# Altium schematic sheet 05_Zynq_Config.SchDoc
size A2; SheetNumber: 6; SheetTotal: 7
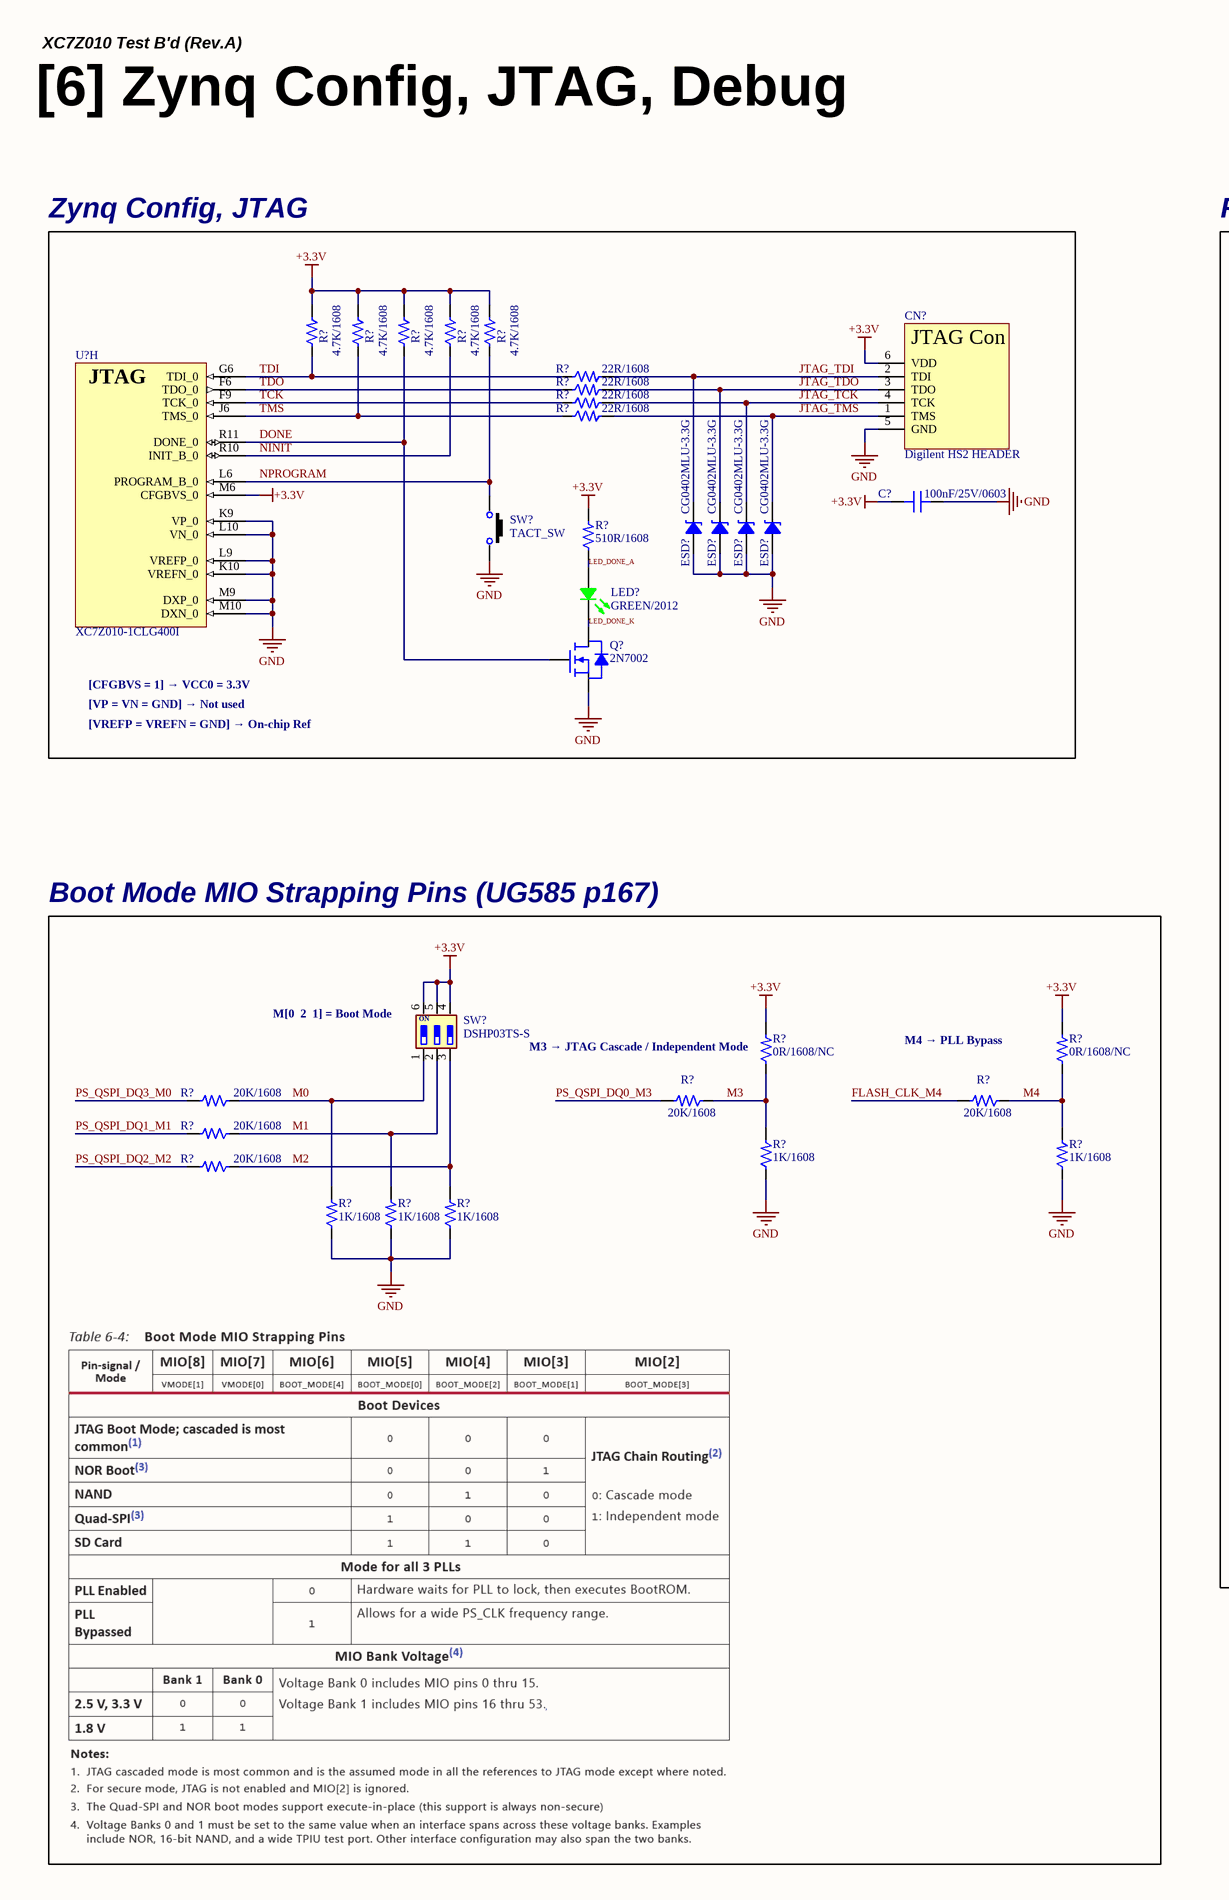
[diagram p0: 05_Zynq_Config.SchDoc, left]
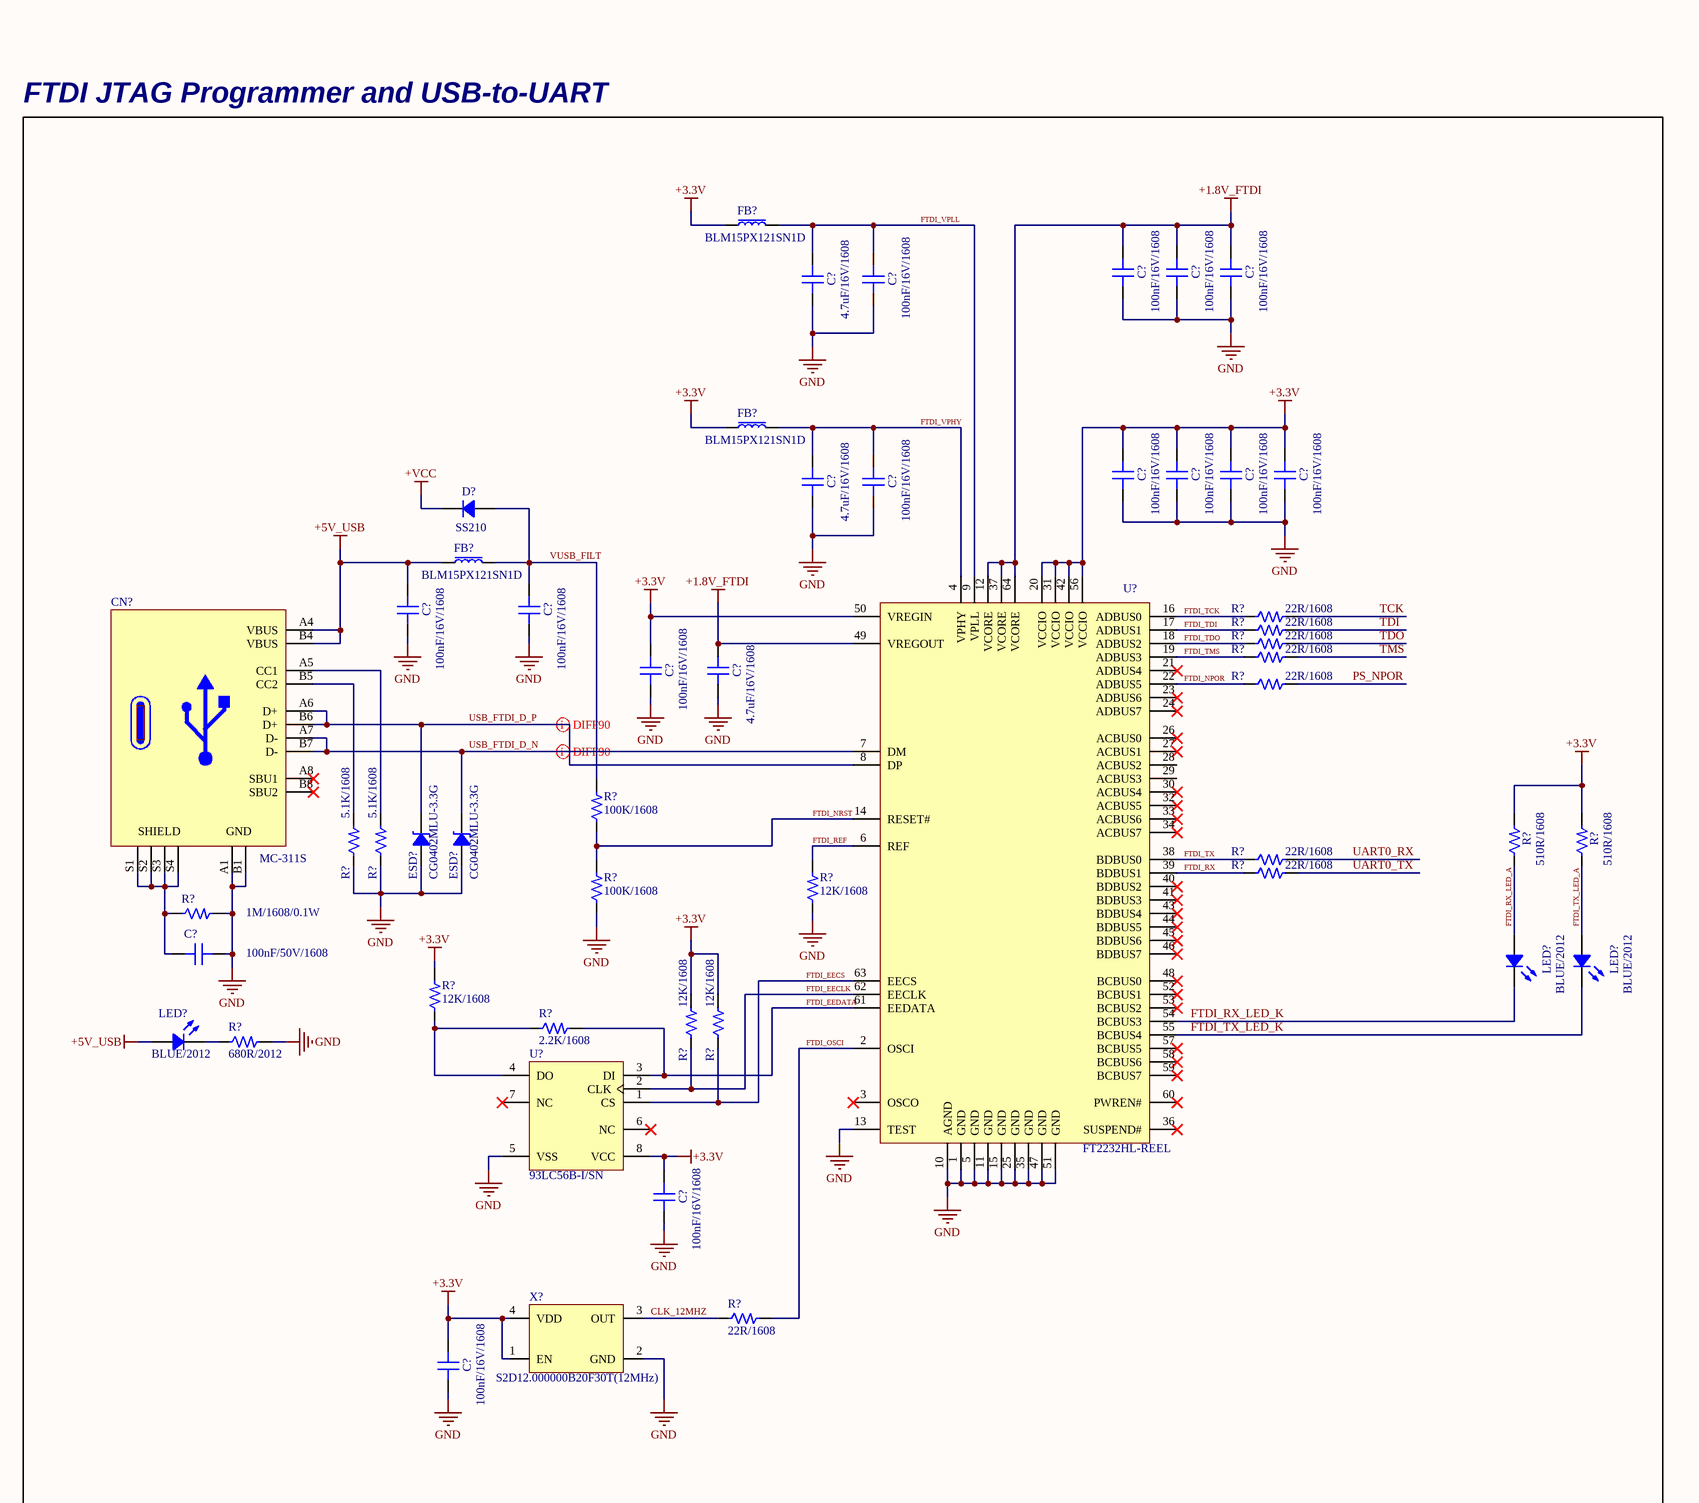
[diagram p1: 05_Zynq_Config.SchDoc, right]

## Parts
(Parts that share a designator on the sheet are numbered #1, #2 ... from top to bottom, then left to right.)
C?#1  100nF/16V/1608  [CAP 1608 (0603_INCH)]
C?#2  100nF/16V/1608  [CAP 1608 (0603_INCH)]
C?#3  100nF/16V/1608  [CAP 1608 (0603_INCH)]
C?#4  4.7uF/16V/1608  [CAP 1608 (0603_INCH)]
C?#5  100nF/16V/1608  [CAP 1608 (0603_INCH)]
C?#6  100nF/25V/0603  [CAP 0603 (0201_INCH)]
C?#7  100nF/16V/1608  [CAP 1608 (0603_INCH)]
C?#8  100nF/16V/1608  [CAP 1608 (0603_INCH)]
C?#9  100nF/16V/1608  [CAP 1608 (0603_INCH)]
C?#10  100nF/16V/1608  [CAP 1608 (0603_INCH)]
C?#11  4.7uF/16V/1608  [CAP 1608 (0603_INCH)]
C?#12  100nF/16V/1608  [CAP 1608 (0603_INCH)]
C?#13  100nF/16V/1608  [CAP 1608 (0603_INCH)]
C?#14  100nF/16V/1608  [CAP 1608 (0603_INCH)]
C?#15  100nF/16V/1608  [CAP 1608 (0603_INCH)]
C?#16  4.7uF/16V/1608  [CAP 1608 (0603_INCH)]
C?#17  100nF/50V/1608  [CAP 1608 (0603_INCH)]
C?#18  100nF/16V/1608  [CAP 1608 (0603_INCH)]
C?#19  100nF/16V/1608  [CAP 1608 (0603_INCH)]
CN?#1  Digilent HS2 HEADER
CN?#2  MC-311S  [CON USB-Type-C (16P)]
D?  SS210  [DIO DO-214AC (SMA)]
ESD?#1  CG0402MLU-3.3G  [RES 1005 (0402_inch)]
ESD?#2  CG0402MLU-3.3G  [RES 1005 (0402_inch)]
ESD?#3  CG0402MLU-3.3G  [RES 1005 (0402_inch)]
ESD?#4  CG0402MLU-3.3G  [RES 1005 (0402_inch)]
ESD?#5  CG0402MLU-3.3G  [RES 1005 (0402_inch)]
ESD?#6  CG0402MLU-3.3G  [RES 1005 (0402_inch)]
FB?#1  BLM15PX121SN1D  [FB 1005 (0402_inch)]
FB?#2  BLM15PX121SN1D  [FB 1005 (0402_inch)]
FB?#3  BLM15PX121SN1D  [FB 1005 (0402_inch)]
LED?#1  GREEN/2012  [LED MHT170RGBCT (GREEN)]
LED?#2  BLUE/2012  [LED MHT170RGBCT (BLUE)]
LED?#3  BLUE/2012  [LED MHT170RGBCT (BLUE)]
LED?#4  BLUE/2012  [LED MHT170RGBCT (BLUE)]
Q?  2N7002  [SOT 23-3 (DIODES INCORPORATED)]
R?#1  4.7K/1608  [RES 1608 (0603_inch)]
R?#2  4.7K/1608  [RES 1608 (0603_inch)]
R?#3  4.7K/1608  [RES 1608 (0603_inch)]
R?#4  4.7K/1608  [RES 1608 (0603_inch)]
R?#5  4.7K/1608  [RES 1608 (0603_inch)]
R?#6  22R/1608  [RES 1608 (0603_inch)]
R?#7  22R/1608  [RES 1608 (0603_inch)]
R?#8  22R/1608  [RES 1608 (0603_inch)]
R?#9  22R/1608  [RES 1608 (0603_inch)]
R?#10  510R/1608  [RES 1608 (0603_inch)]
R?#11  22R/1608  [RES 1608 (0603_inch)]
R?#12  22R/1608  [RES 1608 (0603_inch)]
R?#13  22R/1608  [RES 1608 (0603_inch)]
R?#14  22R/1608  [RES 1608 (0603_inch)]
R?#15  22R/1608  [RES 1608 (0603_inch)]
R?#16  100K/1608  [RES 1608 (0603_inch)]
R?#17  5.1K/1608  [RES 1608 (0603_inch)]
R?#18  5.1K/1608  [RES 1608 (0603_inch)]
R?#19  510R/1608  [RES 1608 (0603_inch)]
R?#20  510R/1608  [RES 1608 (0603_inch)]
R?#21  22R/1608  [RES 1608 (0603_inch)]
R?#22  22R/1608  [RES 1608 (0603_inch)]
R?#23  100K/1608  [RES 1608 (0603_inch)]
R?#24  12K/1608  [RES 1608 (0603_inch)]
R?#25  1M/1608/0.1W  [RES 1608 (0603_inch)]
R?#26  0R/1608/NC  [RES 1608 (0603_inch)/NC]
R?#27  0R/1608/NC  [RES 1608 (0603_inch)/NC]
R?#28  12K/1608  [RES 1608 (0603_inch)]
R?#29  20K/1608  [RES 1608 (0603_inch)]
R?#30  20K/1608  [RES 1608 (0603_inch)]
R?#31  20K/1608  [RES 1608 (0603_inch)]
R?#32  12K/1608  [RES 1608 (0603_inch)]
R?#33  12K/1608  [RES 1608 (0603_inch)]
R?#34  2.2K/1608  [RES 1608 (0603_inch)]
R?#35  20K/1608  [RES 1608 (0603_inch)]
R?#36  680R/2012  [RES 2012 (0805_inch)]
R?#37  1K/1608  [RES 1608 (0603_inch)]
R?#38  1K/1608  [RES 1608 (0603_inch)]
R?#39  20K/1608  [RES 1608 (0603_inch)]
R?#40  1K/1608  [RES 1608 (0603_inch)]
R?#41  1K/1608  [RES 1608 (0603_inch)]
R?#42  1K/1608  [RES 1608 (0603_inch)]
R?#43  22R/1608  [RES 1608 (0603_inch)]
SW?#1  TACT_SW  [SW K2-1102SP-C4SC-04]
SW?#2  DSHP03TS-S  [SW YSS-1201S-2mm]
U?#1  XC7Z010-1CLG400I  (part H of 9)
U?#2  FT2232HL-REEL
U?#3  93LC56B-I/SN
X?  S2D12.000000B20F30T(12MHz)  [OSC SMD_2.5x2.0 (SCTF)]

## Blocks framed on the sheet
Zynq Config, JTAG: C?#6 CN?#1 ESD?#1-ESD?#4 LED?#1 Q? R?#1-R?#10 SW?#1 U?#1
FTDI JTAG Programmer and USB-to-UART: C?#1-C?#5 C?#7-C?#19 CN?#2 D? ESD?#5 ESD?#6 FB?#1-FB?#3 LED?#2-LED?#4 R?#11-R?#25 R?#28 R?#32-R?#34 R?#36 R?#43 U?#2 U?#3 X?
Boot Mode MIO Strapping Pins (UG585 p167): R?#26 R?#27 R?#29-R?#31 R?#35 R?#37-R?#42 SW?#2

## Nets
+1.8V_FTDI: C?#1.2 C?#2.2 C?#3.2 C?#16.2 U?#2.12(VCORE) U?#2.37(VCORE) U?#2.49(VREGOUT) U?#2.64(VCORE)
+3.3V: C?#6.2 C?#7.2 C?#8.2 C?#9.2 C?#10.2 C?#15.2 C?#18.2 C?#19.2 CN?#1.6(VDD) FB?#1.1 FB?#2.1 R?#1.2 R?#2.2 R?#3.2 R?#4.2 R?#5.2 R?#10.2 R?#19.2 R?#20.2 R?#26.2 R?#27.2 R?#28.2 R?#32.2 R?#33.2 SW?#2.4 SW?#2.5 SW?#2.6 U?#1.M6(CFGBVS_0) U?#2.20(VCCIO) U?#2.31(VCCIO) U?#2.42(VCCIO) U?#2.50(VREGIN) U?#2.56(VCCIO) U?#3.8(VCC) X?.1(EN) X?.4(VDD)
+5V_USB: C?#13.2 CN?#2.A4(VBUS) CN?#2.B4(VBUS) FB?#3.1 LED?#4.4(Common_Anode)
+VCC: D?.2
GND: C?#1.1 C?#2.1 C?#3.1 C?#4.1 C?#5.1 C?#6.1 C?#7.1 C?#8.1 C?#9.1 C?#10.1 C?#11.1 C?#12.1 C?#13.1 C?#14.1 C?#15.1 C?#16.1 C?#17.2 C?#18.1 C?#19.1 CN?#1.5(GND) CN?#2.A1(GND) CN?#2.B1(GND) ESD?#1.1 ESD?#2.1 ESD?#3.1 ESD?#4.1 ESD?#5.1 ESD?#6.1 Q?.2(S) R?#17.1 R?#18.1 R?#23.1 R?#24.1 R?#25.2 R?#36.2 R?#37.1 R?#38.1 R?#40.1 R?#41.1 R?#42.1 SW?#1.3 U?#1.K9(VP_0) U?#1.K10(VREFN_0) U?#1.L9(VREFP_0) U?#1.L10(VN_0) U?#1.M9(DXP_0) U?#1.M10(DXN_0) U?#2.1(GND) U?#2.5(GND) U?#2.10(AGND) U?#2.11(GND) U?#2.13(TEST) U?#2.15(GND) U?#2.25(GND) U?#2.35(GND) U?#2.47(GND) U?#2.51(GND) U?#3.5(VSS) X?.2(GND)
CLK_12MHZ: R?#43.1 X?.3(OUT)
DONE: Q?.1(G) R?#3.1 U?#1.R11(DONE_0)
FLASH_CLK_M4: R?#31.2
FTDI_EECLK: R?#32.1 U?#2.62(EECLK) U?#3.2(CLK)
FTDI_EECS: R?#33.1 U?#2.63(EECS) U?#3.1(CS)
FTDI_EEDATA: R?#34.2 U?#2.61(EEDATA) U?#3.3(DI)
FTDI_NPOR: R?#15.1 U?#2.22(ADBUS5)
FTDI_NRST: R?#16.1 R?#23.2 U?#2.14(RESET#)
FTDI_OSCI: R?#43.2 U?#2.2(OSCI)
FTDI_REF: R?#24.2 U?#2.6(REF)
FTDI_RX: R?#22.1 U?#2.39(BDBUS1)
FTDI_RX_LED_A: LED?#2.4(Common_Anode) R?#19.1
FTDI_RX_LED_K: LED?#2.3(BLUE) U?#2.54(BCBUS3)
FTDI_TCK: R?#11.1 U?#2.16(ADBUS0)
FTDI_TDI: R?#12.1 U?#2.17(ADBUS1)
FTDI_TDO: R?#13.1 U?#2.18(ADBUS2)
FTDI_TMS: R?#14.1 U?#2.19(ADBUS3)
FTDI_TX: R?#21.1 U?#2.38(BDBUS0)
FTDI_TX_LED_A: LED?#3.4(Common_Anode) R?#20.1
FTDI_TX_LED_K: LED?#3.3(BLUE) U?#2.55(BCBUS4)
FTDI_VPHY: C?#11.2 C?#12.2 FB?#2.2 U?#2.4(VPHY)
FTDI_VPLL: C?#4.2 C?#5.2 FB?#1.2 U?#2.9(VPLL)
JTAG_TCK: CN?#1.4(TCK) ESD?#3.2 R?#8.2
JTAG_TDI: CN?#1.2(TDI) ESD?#1.2 R?#6.2
JTAG_TDO: CN?#1.3(TDO) ESD?#2.2 R?#7.2
JTAG_TMS: CN?#1.1(TMS) ESD?#4.2 R?#9.2
LED_DONE_A: LED?#1.4(Common_Anode) R?#10.1
LED_DONE_K: LED?#1.2(GREEN) Q?.3(D)
M0: R?#29.1 R?#40.2 SW?#2.1
M1: R?#35.1 R?#41.2 SW?#2.2
M2: R?#39.1 R?#42.2 SW?#2.3
M3: R?#26.1 R?#30.1 R?#37.2
M4: R?#27.1 R?#31.1 R?#38.2
NINIT: R?#4.1 U?#1.R10(INIT_B_0)
NPROGRAM: R?#5.1 SW?#1.1 U?#1.L6(PROGRAM_B_0)
PS_NPOR: R?#15.2
PS_QSPI_DQ0_M3: R?#30.2
PS_QSPI_DQ1_M1: R?#35.2
PS_QSPI_DQ2_M2: R?#39.2
PS_QSPI_DQ3_M0: R?#29.2
TCK: R?#8.1 R?#11.2 U?#1.F9(TCK_0)
TDI: R?#1.1 R?#6.1 R?#12.2 U?#1.G6(TDI_0)
TDO: R?#7.1 R?#13.2 U?#1.F6(TDO_0)
TMS: R?#2.1 R?#9.1 R?#14.2 U?#1.J6(TMS_0)
UART0_RX: R?#21.2
UART0_TX: R?#22.2
USB_FTDI_D_N: CN?#2.A7(D-) CN?#2.B7(D-) ESD?#6.2 U?#2.7(DM)
USB_FTDI_D_P: CN?#2.A6(D+) CN?#2.B6(D+) ESD?#5.2 U?#2.8(DP)
VUSB_FILT: C?#14.2 D?.1 FB?#3.2 R?#16.2
NetC?#17_1: C?#17.1 CN?#2.S1(SHIELD) CN?#2.S2(SHIELD) CN?#2.S3(SHIELD) CN?#2.S4(SHIELD) R?#25.1
NetCN?#2_A5: CN?#2.A5(CC1) R?#18.2
NetCN?#2_B5: CN?#2.B5(CC2) R?#17.2
NetLED?#4_3: LED?#4.3(BLUE) R?#36.1
NetR?#28_1: R?#28.1 R?#34.1 U?#3.4(DO)

Not connected (* = marked no-connect by the designer): CN?#2 A8(SBU1)* B8(SBU2)*; U?#2 3(OSCO)* 21(ADBUS4)* 23(ADBUS6)* 24(ADBUS7)* 26(ACBUS0)* 27(ACBUS1)* 28(ACBUS2) 29(ACBUS3) 30(ACBUS4)* 32(ACBUS5)* 33(ACBUS6)* 34(ACBUS7)* 36(SUSPEND#)* 40(BDBUS2)* 41(BDBUS3)* 43(BDBUS4)* 44(BDBUS5)* 45(BDBUS6)* 46(BDBUS7)* 48(BCBUS0)* 52(BCBUS1)* 53(BCBUS2)* 57(BCBUS5)* 58(BCBUS6)* 59(BCBUS7)* 60(PWREN#)*; U?#3 6(NC)* 7(NC)*

## Layout directives
differential pair; differential pair class DIFF90: USB_FTDI_D_N, USB_FTDI_D_P

## Notes on the sheet
- XC7Z010 Test B'd (Rev.A)
- [6] Zynq Config, JTAG, Debug
- [CFGBVS = 1] → VCC0 = 3.3V
- [VP = VN = GND] → Not used
- [VREFP = VREFN = GND] → On-chip Ref
- (near SW?#2) M[0  2  1] = Boot Mode
- (near R?#26) M3 → JTAG Cascade / Independent Mode
- M4 → PLL Bypass
- Title
- Rev
- Doc
- Sheet #
- of
- Author
- This document is copyright of ArkX and shall not be revealed, produced, copied, in whole or in part,
- Date
- nor used for any purpose other than submitted.
- (in symbol CON_Digilent_HS2_HEADER) JTAG Con
- (in symbol IC_SOC_XC7Z010-1CLG400I, part H) JTAG
- (in symbol SW_DSHP03TS-S) ON

## Library data of the parts
C?#1-C?#3 C?#5 C?#7-C?#10 C?#12-C?#15 C?#18 C?#19 = CAP_100nF/16V/1608: Ceramic CAP_100nF/16V/1608; LCSC Part #: C66501; JLCPCB Part Type: Extended Part
C?#4 C?#11 C?#16 = CAP_4.7uF/16V/1608: Ceramic CAP_4.7uF/16V/1608; LCSC Part #: C19666; JLCPCB Part Type: Basic Part
C?#6 = CAP_100nF/25V/0603: Ceramic CAP_100nF/25V/0603; JLCPCB Part Type: Extended Part; LCSC Part #: C181047
C?#17 = CAP_100nF/50V/1608: Ceramic CAP_100nF/50V/1608; LCSC Part #: C14663; JLCPCB Part Type: Basic Part
CN?#1 = CON_Digilent_HS2_HEADER: 2.54mm pitch 6pin-header for Digilent HS2 Cable
CN?#2 = CON_USB-Type-C: USB 2.0 5A 1 Surface Mount 16 Female -35℃~+75℃ Type-C SMD  USB Connectors ROHS; LCSC Part #: C2977718; JLCPCB Part Type: Extended Part
D? = DIO_SS210: 100V 850mV@2A 2A SMA(DO-214AC)  Schottky Barrier Diodes (SBD) ROHS; LCSC Part #: C14996; JLCPCB Part Type: Basic Part
ESD?#1-ESD?#6 = ESD_CG0402MLU-3.3G: Varistor 1 Circuit Surface Mount, MLCV 0402 (1005 Metric); LCSC Part #: C2655393; JLCPCB Part Type: Extended Part
FB?#1-FB?#3 = FB_BLM15PX121SN1D: 55mΩ ±25% 120Ω@100MHz 0402  Ferrite Beads ROHS; LCSC Part #: C88970; JLCPCB Part Type: Extended Part
LED?#1 = LED_MHT170RGBCT(GREEN): Colorless transparence -30℃~+85℃ Positive post Common anode RGB 120° 0805  Light Emitting Diodes (LED) ROHS; LCSC Part #: C2962094; JLCPCB Part Type: Extended Part
LED?#2-LED?#4 = LED_MHT170RGBCT(BLUE): Colorless transparence -30℃~+85℃ Positive post Common anode RGB 120° 0805  Light Emitting Diodes (LED) ROHS; LCSC Part #: C2962094; JLCPCB Part Type: Extended Part
Q? = FET_2N7002: 60V 115mA 200mW 7.5Ω@10V,500mA N Channel SOT-23  MOSFETs ROHS; LCSC Part #: C8545; JLCPCB Part Type: Basic Part
R?#1-R?#5 = RES_4.7K/1608/0.1W: Value: 4.7K; Power Rating: 0.1W; Precision: 1%; Size: 1608; LCSC Part #: C23162; JLCPCB Part Type: Basic Part
R?#6-R?#9 R?#11-R?#15 R?#21 R?#22 R?#43 = RES_22R/1608/0.1W: Value: 22R; Power Rating: 0.1W; Precision: 1%; Size: 1608; LCSC Part #: C23345; JLCPCB Part Type: Basic Part
R?#10 R?#19 R?#20 = RES_510R/1608/0.1W: Value: 510R; Power Rating: 0.1W; Precision: 1%; Size: 1608; LCSC Part #: C23193; JLCPCB Part Type: Basic Part
R?#16 R?#23 = RES_100K/1608/0.1W: Value: 100K; Power Rating: 0.1W; Precision: 1%; Size: 1608; LCSC Part #: C25803; JLCPCB Part Type: Basic Part
R?#17 R?#18 = RES_5.1K/1608/0.1W: Value: 5.1K; Power Rating: 0.1W; Precision: 1%; Size: 1608; LCSC Part #: C23186; JLCPCB Part Type: Basic Part
R?#24 R?#28 R?#32 R?#33 = RES_12K/1608/0.1W: Value: 12K; Power Rating: 0.1W; Precision: 1%; Size: 1608; LCSC Part #: C22790; JLCPCB Part Type: Basic Part
R?#25 = RES_1M/1608/0.1W: Value: 1M; Power Rating: 0.1W; Precision: 1%; Size: 1608; LCSC Part #: C22935; JLCPCB Part Type: Basic Part
R?#26 R?#27 = RES_NC_0R/1608/0.1W: 0R/1608/0.1W/NC; Value: 0R; Power Rating: 0.1W; Precision: 1%; Size: 1608
R?#29-R?#31 R?#35 R?#39 = RES_20K/1608/0.1W: Value: 20K; Power Rating: 0.1W; Precision: 1%; Size: 1608; LCSC Part #: C4184; JLCPCB Part Type: Basic Part
R?#34 = RES_2.2K/1608/0.1W: Value: 2.2K; Power Rating: 0.1W; Precision: 1%; Size: 1608; LCSC Part #: C4190; JLCPCB Part Type: Basic Part
R?#36 = RES_680R/2012/0.125W: Value: 680R; Power Rating: 0.125W; Precision: 1%; Size: 2012; LCSC Part #: C17798; JLCPCB Part Type: Basic Part
R?#37 R?#38 R?#40-R?#42 = RES_1K/1608/0.1W: Value: 1K; Power Rating: 0.1W; Precision: 1%; Size: 1608; LCSC Part #: C21190; JLCPCB Part Type: Basic Part
SW?#1 = SW_K2-1102SP-C4SC-04(2P): -25℃~+85℃ 6mm 5mm Round Button 50mA Brick nogging 6mm SPST 100MΩ 100000 250gf@±30gf 12V SMD  Tactile Switches ROHS; LCSC Part #: C127509; JLCPCB Part Type: Extended Part
SW?#2 = SW_DSHP03TS-S: 3Bit SPST 24V 25mA Black 3000次 Slide (Standard), SMD-6P,5.4x5.4mm  DIP Switches ROHS; LCSC Part #: C319051; JLCPCB Part Type: Extended Part
U?#1 = IC_SOC_XC7Z010-1CLG400I: Dual ARM® Cortex®-A9 MPCore™ with CoreSight™ System On Chip (SOC) IC Zynq®-7000 Artix™-7 FPGA, 28K Logic Cells 766MHz 400-CSPBGA (17x17)
U?#2 = IC_USB_FT2232HL-REEL: USB Bridge, USB to UART,FIFO USB 2.0 UART Interface 64-LQFP (10x10); LCSC Part #: C27882; JLCPCB Part Type: Extended Part
U?#3 = IC_EEPROM_93LC56B-I/SN: EEPROM Memory IC 2Kbit Microwire 2 MHz 8-SOIC; LCSC Part #: C183620; JLCPCB Part Type: Extended Part
X? = OSC_S2D12.000000B20F30T(12MHz): 3.3V~3.3V -40℃~+85℃ 20mA ±20ppm 12MHz SMD2520-4P  Oscillators ROHS; LCSC Part #: C387449; JLCPCB Part Type: Extended Part